# Altium project XPIRL_1V2.PrjPCB
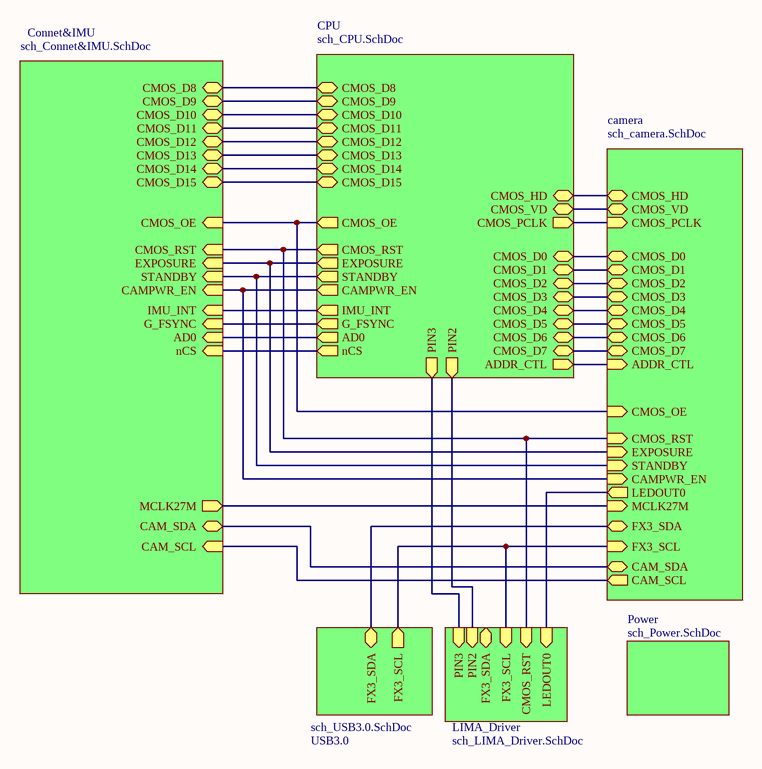
[diagram p0: sch_Top.SchDoc]
7 sheets, 248 parts. Net scope: hierarchical (ports join the sheet entries above them; power ports are global).
Sheets:
  sch_Top.SchDoc
    CPU = sch_CPU.SchDoc
    Connet&IMU = sch_Connet&IMU.SchDoc
    camera = sch_camera.SchDoc
    USB3.0 = sch_USB3.0.SchDoc
    Power = sch_Power.SchDoc
    LIMA_Driver = sch_LIMA_Driver.SchDoc

## Sheet sch_Top.SchDoc
size A4

### Sub-sheets
camera = sch_camera.SchDoc: CMOS_D0 (bidir), CMOS_D1 (bidir), CMOS_D2 (bidir), CMOS_D3 (bidir), CMOS_D4 (bidir), CMOS_D5 (bidir), CMOS_D6 (bidir), CMOS_D7 (bidir), CAMPWR_EN (in), CMOS_HD (bidir), CMOS_VD (bidir), CMOS_OE (in), CMOS_PCLK (in), CMOS_RST (in), EXPOSURE (in), STANDBY (in), ADDR_CTL (in), FX3_SCL (in), FX3_SDA (bidir), MCLK27M (in), LEDOUT0 (out), CAM_SDA (bidir), CAM_SCL (out)
Connet&IMU = sch_Connet&IMU.SchDoc: CAM_SCL (in), AD0 (in), nCS (in), STANDBY (in), EXPOSURE (in), CMOS_OE (in), CAMPWR_EN (in), CMOS_RST (in), CAM_SDA (bidir), CMOS_D8 (bidir), CMOS_D9 (bidir), CMOS_D10 (bidir), CMOS_D11 (bidir), CMOS_D12 (bidir), CMOS_D13 (bidir), CMOS_D14 (bidir), CMOS_D15 (bidir), IMU_INT (in), G_FSYNC (in), MCLK27M (out)
CPU = sch_CPU.SchDoc: AD0 (out), ADDR_CTL (out), CAMPWR_EN (out), CMOS_D0 (bidir), CMOS_D1 (bidir), CMOS_D2 (bidir), CMOS_D3 (bidir), CMOS_D4 (bidir), CMOS_D5 (bidir), CMOS_D6 (bidir), CMOS_D7 (bidir), CMOS_D8 (bidir), CMOS_D9 (bidir), CMOS_D10 (bidir), CMOS_D11 (bidir), CMOS_D12 (bidir), CMOS_D13 (bidir), CMOS_D14 (bidir), CMOS_D15 (bidir), CMOS_HD (bidir), CMOS_VD (bidir), CMOS_OE (out), CMOS_PCLK (out), CMOS_RST (out), EXPOSURE (out), IMU_INT (out), G_FSYNC (out), STANDBY (out), nCS (out), PIN3 (out), PIN2 (out)
LIMA_Driver = sch_LIMA_Driver.SchDoc: FX3_SDA (bidir), FX3_SCL (in), LEDOUT0 (in), PIN3 (in), PIN2 (in), CMOS_RST (in)
Power = sch_Power.SchDoc: no entries
USB3.0 = sch_USB3.0.SchDoc: FX3_SDA (bidir), FX3_SCL (out)

### Nets
AD0: sheet CPU/AD0, sheet Connet&IMU/AD0
ADDR_CTL: sheet CPU/ADDR_CTL, sheet camera/ADDR_CTL
CAM_SCL: sheet Connet&IMU/CAM_SCL, sheet camera/CAM_SCL
CAM_SDA: sheet Connet&IMU/CAM_SDA, sheet camera/CAM_SDA
CAMPWR_EN: sheet CPU/CAMPWR_EN, sheet Connet&IMU/CAMPWR_EN, sheet camera/CAMPWR_EN
CMOS_D0: sheet CPU/CMOS_D0, sheet camera/CMOS_D0
CMOS_D1: sheet CPU/CMOS_D1, sheet camera/CMOS_D1
CMOS_D2: sheet CPU/CMOS_D2, sheet camera/CMOS_D2
CMOS_D3: sheet CPU/CMOS_D3, sheet camera/CMOS_D3
CMOS_D4: sheet CPU/CMOS_D4, sheet camera/CMOS_D4
CMOS_D5: sheet CPU/CMOS_D5, sheet camera/CMOS_D5
CMOS_D6: sheet CPU/CMOS_D6, sheet camera/CMOS_D6
CMOS_D7: sheet CPU/CMOS_D7, sheet camera/CMOS_D7
CMOS_D8: sheet CPU/CMOS_D8, sheet Connet&IMU/CMOS_D8
CMOS_D9: sheet CPU/CMOS_D9, sheet Connet&IMU/CMOS_D9
CMOS_D10: sheet CPU/CMOS_D10, sheet Connet&IMU/CMOS_D10
CMOS_D11: sheet CPU/CMOS_D11, sheet Connet&IMU/CMOS_D11
CMOS_D12: sheet CPU/CMOS_D12, sheet Connet&IMU/CMOS_D12
CMOS_D13: sheet CPU/CMOS_D13, sheet Connet&IMU/CMOS_D13
CMOS_D14: sheet CPU/CMOS_D14, sheet Connet&IMU/CMOS_D14
CMOS_D15: sheet CPU/CMOS_D15, sheet Connet&IMU/CMOS_D15
CMOS_HD: sheet CPU/CMOS_HD, sheet camera/CMOS_HD
CMOS_OE: sheet CPU/CMOS_OE, sheet Connet&IMU/CMOS_OE, sheet camera/CMOS_OE
CMOS_PCLK: sheet CPU/CMOS_PCLK, sheet camera/CMOS_PCLK
CMOS_RST: sheet CPU/CMOS_RST, sheet Connet&IMU/CMOS_RST, sheet camera/CMOS_RST, sheet LIMA_Driver/CMOS_RST
CMOS_VD: sheet CPU/CMOS_VD, sheet camera/CMOS_VD
EXPOSURE: sheet CPU/EXPOSURE, sheet Connet&IMU/EXPOSURE, sheet camera/EXPOSURE
FX3_SCL: sheet camera/FX3_SCL, sheet USB3.0/FX3_SCL, sheet LIMA_Driver/FX3_SCL
FX3_SDA: sheet camera/FX3_SDA, sheet USB3.0/FX3_SDA
G_FSYNC: sheet CPU/G_FSYNC, sheet Connet&IMU/G_FSYNC
IMU_INT: sheet CPU/IMU_INT, sheet Connet&IMU/IMU_INT
LEDOUT0: sheet camera/LEDOUT0, sheet LIMA_Driver/LEDOUT0
MCLK27M: sheet Connet&IMU/MCLK27M, sheet camera/MCLK27M
nCS: sheet CPU/nCS, sheet Connet&IMU/nCS
PIN2: sheet CPU/PIN2, sheet LIMA_Driver/PIN2
PIN3: sheet CPU/PIN3, sheet LIMA_Driver/PIN3
STANDBY: sheet CPU/STANDBY, sheet Connet&IMU/STANDBY, sheet camera/STANDBY

## Sheet sch_CPU.SchDoc
size A4
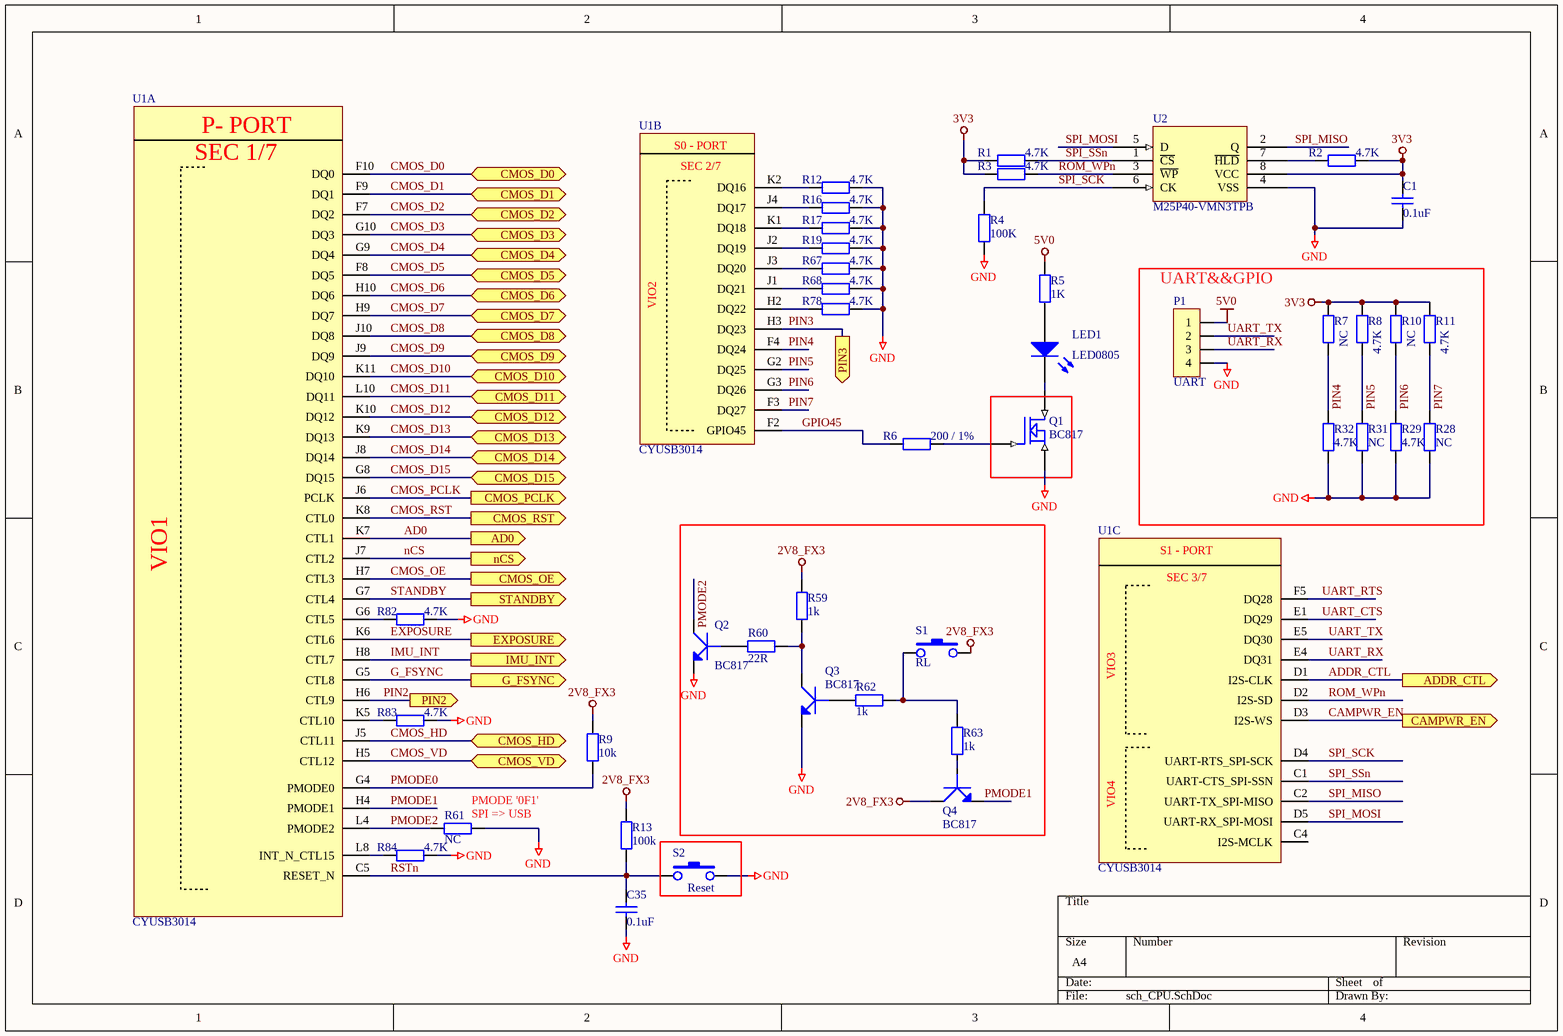
[diagram p1: sch_CPU.SchDoc]

### Parts
C1  0.1uF  [0402C]
C35  0.1uF  [0402C]
LED1  LED0805  [LED0805A_L210W100H60]
P1  UART  [WAFER4_P1.25L6.25W3.4H4.3]
Q1  BC817  [SOT-23L]
Q2  BC817  [SOT-23L]
Q3  BC817  [SOT-23L]
Q4  BC817  [SOT-23L]
R1  4.7K  [0402R]
R2  4.7K  [0402R]
R3  4.7K  [0402R]
R4  100K  [0402R]
R5  1K  [0402R]
R6  value 200 / 1%  [0402R]  (hidden comment: 200R)
R7  NC  [0402R]
R8  4.7K  [0402R]
R9  10K  [0402R]
R10  NC  [0402R]
R11  4.7K  [0402R]
R12  4.7K  [0402R]
R13  100K  [0402R]
R16  4.7K  [0402R]
R17  4.7K  [0402R]
R19  4.7K  [0402R]
R28  NC  [0402R]
R29  4.7K  [0402R]
R31  value NC  [0402R]  (hidden comment: NC\)
R32  4.7K  [0402R]
R59  1K  [0402R]
R60  22R  [0402R]
R61  NC  [0805R]
R62  1k  [0402R]
R63  1k  [0402R]
R67  4.7K  [0402R]
R68  4.7K  [0402R]
R78  4.7K  [0402R]
R82  4.7K  [0402R]
R83  4.7K  [0402R]
R84  4.7K  [0402R]
S1  RL  [SW_L40W30H25_MPTFP]
S2  Reset  [SW_L40W30H25_MPTFP]
U1  CYUSB3014  [FBGA121_P80L100W100H11]  (parts A,B,C of 7)
U2  M25P40-VMN3TPB  [SO8N_P127L50W40W62H17]

### Blocks framed on the sheet
UART&&GPIO: P1 R7 R8 R10 R11 R28 R29 R31 R32

### Ports
AD0 (out), ADDR_CTL (out), CAMPWR_EN (out), CMOS_D0 (bidir), CMOS_D1 (bidir), CMOS_D2 (bidir), CMOS_D3 (bidir), CMOS_D4 (bidir), CMOS_D5 (bidir), CMOS_D6 (bidir), CMOS_D7 (bidir), CMOS_D8 (bidir), CMOS_D9 (bidir), CMOS_D10 (bidir), CMOS_D11 (bidir), CMOS_D12 (bidir), CMOS_D13 (bidir), CMOS_D14 (bidir), CMOS_D15 (bidir), CMOS_HD (bidir), CMOS_OE (out), CMOS_PCLK (out), CMOS_RST (out), CMOS_VD (bidir), EXPOSURE (out), G_FSYNC (out), IMU_INT (out), nCS (out), PIN2 (out), PIN3 (out), STANDBY (out)

### Nets
2V8_FX3: Q4.3(C) R9.1 R13.1 R59.2 S1.1
3V3: C1.2 R1.1 R2.2 R3.1 R7.2 R8.2 R10.2 R11.2 U2.8(VCC)
5V0: P1.1 R5.1
GND: C1.1 C35.1 P1.4 Q1.2(S) Q2.2(E) Q3.2(E) R4.1 R12.2 R16.2 R17.2 R19.2 R28.2 R29.2 R31.2 R32.2 R61.1 R67.2 R68.2 R78.2 R82.2 R83.2 R84.2 S2.2 U2.4(VSS)
AD0: U1.K7(CTL1) ; port AD0
ADDR_CTL: U1.D1(I2S-CLK) ; port ADDR_CTL
CAMPWR_EN: U1.D3(I2S-WS) ; port CAMPWR_EN
CMOS_D0: U1.F10(DQ0) ; port CMOS_D0
CMOS_D1: U1.F9(DQ1) ; port CMOS_D1
CMOS_D2: U1.F7(DQ2) ; port CMOS_D2
CMOS_D3: U1.G10(DQ3) ; port CMOS_D3
CMOS_D4: U1.G9(DQ4) ; port CMOS_D4
CMOS_D5: U1.F8(DQ5) ; port CMOS_D5
CMOS_D6: U1.H10(DQ6) ; port CMOS_D6
CMOS_D7: U1.H9(DQ7) ; port CMOS_D7
CMOS_D8: U1.J10(DQ8) ; port CMOS_D8
CMOS_D9: U1.J9(DQ9) ; port CMOS_D9
CMOS_D10: U1.K11(DQ10) ; port CMOS_D10
CMOS_D11: U1.L10(DQ11) ; port CMOS_D11
CMOS_D12: U1.K10(DQ12) ; port CMOS_D12
CMOS_D13: U1.K9(DQ13) ; port CMOS_D13
CMOS_D14: U1.J8(DQ14) ; port CMOS_D14
CMOS_D15: U1.G8(DQ15) ; port CMOS_D15
CMOS_HD: U1.J5(CTL11) ; port CMOS_HD
CMOS_OE: U1.H7(CTL3) ; port CMOS_OE
CMOS_PCLK: U1.J6(PCLK) ; port CMOS_PCLK
CMOS_RST: U1.K8(CTL0) ; port CMOS_RST
CMOS_VD: U1.H5(CTL12) ; port CMOS_VD
EXPOSURE: U1.K6(CTL6) ; port EXPOSURE
G_FSYNC: U1.G5(CTL8) ; port G_FSYNC
GPIO45: R6.1 U1.F2(GPIO45)
IMU_INT: U1.H8(CTL7) ; port IMU_INT
nCS: U1.J7(CTL2) ; port nCS
PIN2: U1.H6(CTL9) ; port PIN2
PIN3: U1.H3(DQ23) ; port PIN3
PIN4: R7.1 R32.1 U1.F4(DQ24)
PIN5: R8.1 R31.1 U1.G2(DQ25)
PIN6: R10.1 R29.1 U1.G3(DQ26)
PIN7: R11.1 R28.1 U1.F3(DQ27)
PMODE0: R9.2 U1.G4(PMODE0)
PMODE1: Q4.2(E) U1.H4(PMODE1)
PMODE2: Q2.3(C) R61.2 U1.L4(PMODE2)
ROM_WPn: R3.2 U1.D2(I2S-SD) U2.3(~{WP})
RSTn: C35.2 R13.2 S2.1 U1.C5(RESET_N)
SPI_MISO: U1.C2(UART-TX_SPI-MISO) U2.2(Q)
SPI_MOSI: U1.D5(UART-RX_SPI-MOSI) U2.5(D)
SPI_SCK: R4.2 U1.D4(UART-RTS_SPI-SCK) U2.6(CK)
SPI_SSn: R1.2 U1.C1(UART-CTS_SPI-SSN) U2.1(~{CS})
STANDBY: U1.G7(CTL4) ; port STANDBY
UART_CTS: U1.E1(DQ29)
UART_RTS: U1.F5(DQ28)
UART_RX: P1.3 U1.E4(DQ31)
UART_TX: P1.2 U1.E5(DQ30)
NetLED1_1: LED1.1(A) R5.2
NetLED1_2: LED1.2(K) Q1.3(D)
NetQ1_1: Q1.1(G) R6.2
NetQ2_1: Q2.1(B) R60.1
NetQ3_1: Q3.1(B) R62.2
NetQ3_3: Q3.3(C) R59.1 R60.2
NetQ4_1: Q4.1(B) R63.2
NetR2_1: R2.1 U2.7(~{HLD})
NetR12_1: R12.1 U1.K2(DQ16)
NetR16_1: R16.1 U1.J4(DQ17)
NetR17_1: R17.1 U1.K1(DQ18)
NetR19_1: R19.1 U1.J2(DQ19)
NetR62_1: R62.1 R63.1 S1.2
NetR67_1: R67.1 U1.J3(DQ20)
NetR68_1: R68.1 U1.J1(DQ21)
NetR78_1: R78.1 U1.H2(DQ22)
NetR82_1: R82.1 U1.G6(CTL5)
NetR83_1: R83.1 U1.K5(CTL10)
NetR84_1: R84.1 U1.L8(INT_N_CTL15)

Not connected (* = marked no-connect by the designer): U1 C4(I2S-MCLK)

### Notes on the sheet
- (near R61) PMODE '0F1'
- (near R61) SPI => USB
- (in symbol CYUSB3014, part A) P- PORT; SEC 1/7; VIO1
- (in symbol CYUSB3014, part B) S0 - PORT; SEC 2/7
- (in symbol CYUSB3014, part C) S1 - PORT; SEC 3/7

### Library data of the parts
C1 C35 = Cap: Capacitor; Published: 8-Jun-2000; LatestRevisionDate: 17-Jul-2002; LatestRevisionNote: Re-released for DXP Platform.; PackageReference: RAD-0.3; Publisher: Altium Limited; Value: 0.1uF
LED1 = LED: 发光二级管
P1 = CON4
Q1 = MOSFET N
Q2-Q4 = NPN: NPN Transistor
R1-R13 R16 R17 R19 R28 R29 R31 R32 R59 R61-R63 R67 R68 R78 R82-R84 = Resistor: Published: 8-Jun-2000; LatestRevisionDate: 17-Jul-2002; LatestRevisionNote: Re-released for DXP Platform.; PackageReference: AXIAL-0.4; Publisher: Altium Limited
  R1-R3 R8 R11 R12 R16 R17 R19 R29 R32 R67 R68 R78 R82-R84: Value: 4.7K
  R4: Value: 100K
  R5: Value: 1K
  R7 R10 R28 R61: Value: NC
  R9: Value: 10k
  R13: Value: 100k
  R59 R62 R63: Value: 1k
R60 = Resistor: Value: 10k; Published: 8-Jun-2000; LatestRevisionDate: 17-Jul-2002; LatestRevisionNote: Re-released for DXP Platform.; PackageReference: AXIAL-0.4; Publisher: Altium Limited
S1 S2 = Button_sop: Value: BUTTON

## Sheet sch_Connet&IMU.SchDoc
size A4
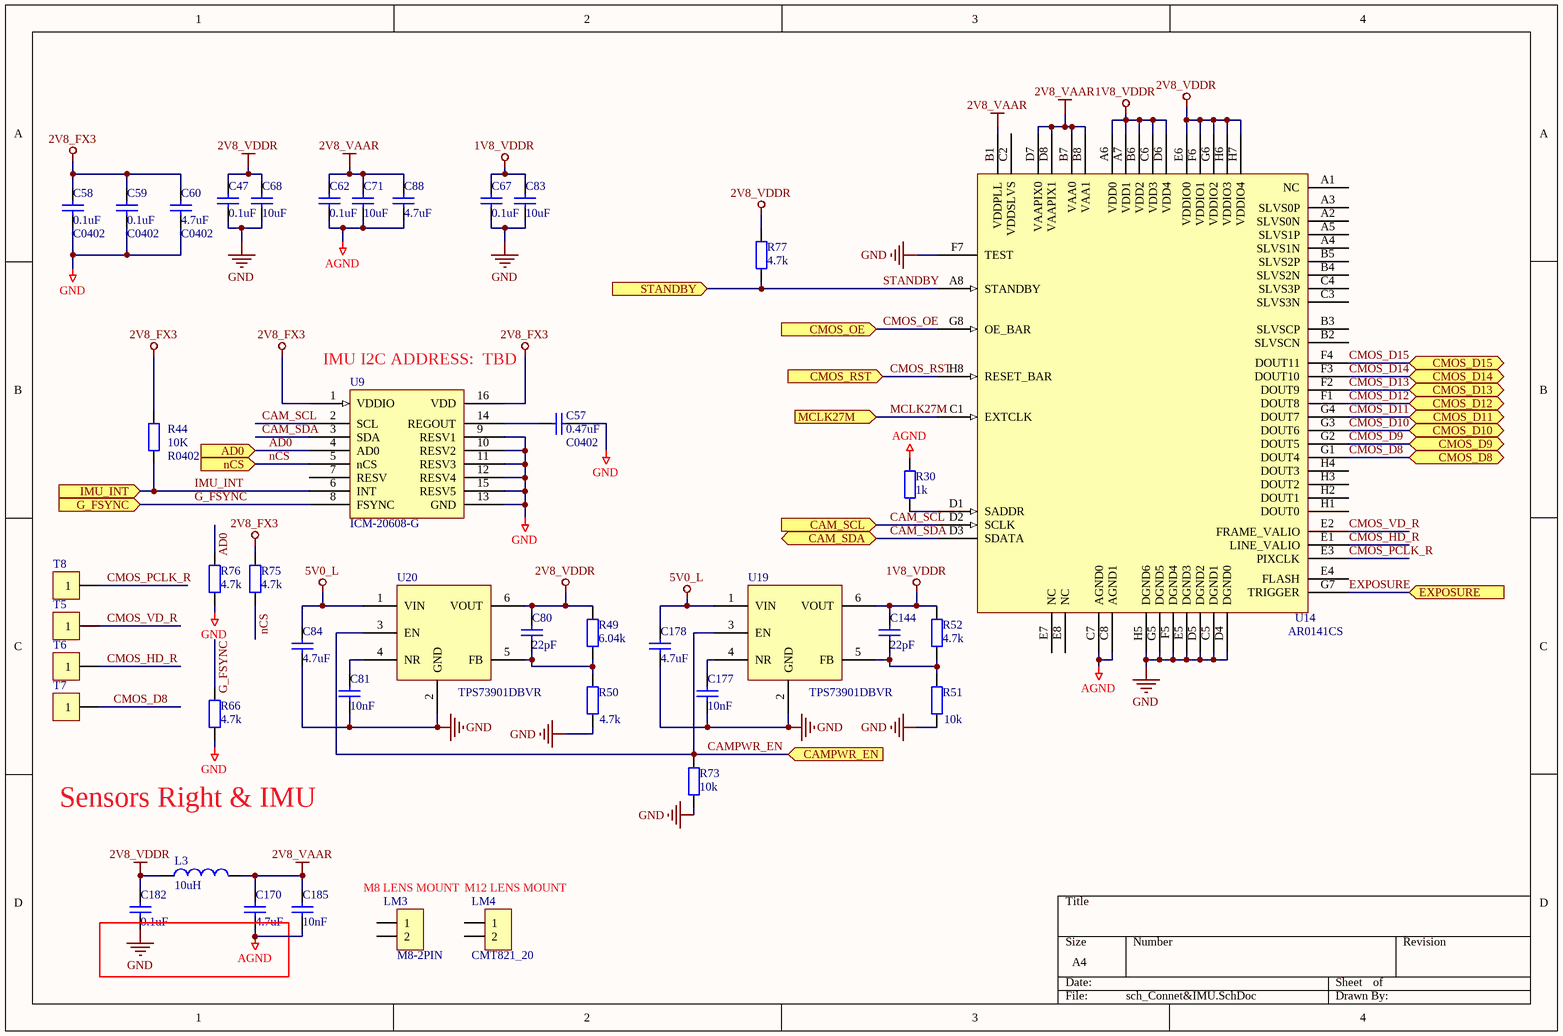
[diagram p2: sch_Connet&IMU.SchDoc]

### Parts
C47  0.1uF  [0402C]
C57  0.47uF  value C0402  [0402C]
C58  0.1uF  value C0402  [0402C]
C59  0.1uF  value C0402  [0402C]
C60  4.7uF  value C0402  [0402C]
C62  0.1uF  [0402C]
C67  0.1uF  [0402C]
C68  10uF  [0805C]
C71  10uF  [0805C]
C80  22pF  [0805C]
C81  10nF  [0402C_L]
C83  10uF  [0805C]
C84  4.7uF  [0402C_L]
C88  4.7uF  [0805C]
C144  22pF  [0402C]
C170  4.7uF  [0402C]
C177  10nF  [0402C_L]
C178  4.7uF  [0402C_L]
C182  0.1uF  [0402C_L]
C185  10nF  [0402C_L]
L3  10uH  [0805R]
LM3  M8-2PIN  [PAD_M3_D350_450]
LM4  CMT821_20  [PAD_M3_D350_450]
R30  1k  [0402R]
R44  10K  value R0402  [0402R]
R49  6.04K  [0402R]
R50  4.7K  [0402R]
R51  10K  [0402R]
R52  4.7K  [0402R]
R66  4.7K  [0402R]
R73  10K  [0402R_L]
R75  4.7K  [0402R]
R76  4.7K  [0402R]
R77  4.7K  [0402R]
T5  CON1  [PAD_TP_D1.2]  (value not drawn)
T6  CON1  [PAD_TP_D1.2]  (value not drawn)
T7  CON1  [PAD_TP_D1.2]  (value not drawn)
T8  CON1  [PAD_TP_D1.2]  (value not drawn)
U9  ICM-20608-G  [LGA16_P50L30W30H08]
U14  AR0141CS
U19  TPS73901DBVR
U20  TPS73901DBVR

### Ports
AD0 (in), CAM_SCL (in), CAM_SDA (bidir), CAMPWR_EN (in), CMOS_D8 (bidir), CMOS_D9 (bidir), CMOS_D10 (bidir), CMOS_D11 (bidir), CMOS_D12 (bidir), CMOS_D13 (bidir), CMOS_D14 (bidir), CMOS_D15 (bidir), CMOS_OE (in), CMOS_RST (in), EXPOSURE (in), G_FSYNC (in), IMU_INT (in), MCLK27M (in), nCS (in), STANDBY (in)

### Nets
1V8_VDDR: C67.2 C83.2 C144.2 R52.2 U14.A6(VDD0) U14.A7(VDD1) U14.B6(VDD2) U14.C6(VDD3) U14.D6(VDD4) U19.6(VOUT)
2V8_FX3: C58.2 C59.2 C60.2 R44.2 R75.2 U9.1(VDDIO) U9.16(VDD)
2V8_VAAR: C62.2 C71.2 C88.2 C170.2 C185.2 L3.2 U14.B1(VDDPLL) U14.B7(VAA0) U14.B8(VAA1) U14.D7(VAAPIX0) U14.D8(VAAPIX1)
2V8_VDDR: C47.2 C68.2 C80.2 C182.2 L3.1 R49.2 R77.2 U14.E6(VDDIO0) U14.F6(VDDIO1) U14.G6(VDDIO2) U14.H6(VDDIO3) U14.H7(VDDIO4) U20.6(VOUT)
5V0_L: C84.2 C178.2 U19.1(VIN) U20.1(VIN)
AGND: C62.1 C71.1 C88.1 C170.1 C185.1 R30.1 U14.C7(AGND0) U14.C8(AGND1)
GND: C47.1 C57.1 C58.1 C59.1 C60.1 C67.1 C68.1 C81.1 C83.1 C84.1 C177.1 C178.1 C182.1 R50.2 R51.2 R66.1 R73.2 R76.1 U9.9(RESV1) U9.10(RESV2) U9.11(RESV3) U9.12(RESV4) U9.13(GND) U9.15(RESV5) U14.C5(DGND1) U14.D4(DGND0) U14.D5(DGND2) U14.E5(DGND3) U14.F5(DGND4) U14.F7(TEST) U14.G5(DGND5) U14.H5(DGND6) U19.2(GND) U20.2(GND)
AD0: R76.2 U9.4(AD0) ; port AD0
CAM_SCL: U9.2(SCL) U14.D2(SCLK) ; port CAM_SCL
CAM_SDA: U9.3(SDA) U14.D3(SDATA) ; port CAM_SDA
CAMPWR_EN: R73.1 U19.3(EN) U20.3(EN) ; port CAMPWR_EN
CMOS_D8: T7.1 U14.G1(DOUT4) ; port CMOS_D8
CMOS_D9: U14.G2(DOUT5) ; port CMOS_D9
CMOS_D10: U14.G3(DOUT6) ; port CMOS_D10
CMOS_D11: U14.G4(DOUT7) ; port CMOS_D11
CMOS_D12: U14.F1(DOUT8) ; port CMOS_D12
CMOS_D13: U14.F2(DOUT9) ; port CMOS_D13
CMOS_D14: U14.F3(DOUT10) ; port CMOS_D14
CMOS_D15: U14.F4(DOUT11) ; port CMOS_D15
CMOS_HD_R: T6.1 U14.E1(LINE_VALIO)
CMOS_OE: U14.G8(OE_BAR) ; port CMOS_OE
CMOS_PCLK_R: T8.1 U14.E3(PIXCLK)
CMOS_RST: U14.H8(RESET_BAR) ; port CMOS_RST
CMOS_VD_R: T5.1 U14.E2(FRAME_VALIO)
EXPOSURE: U14.G7(TRIGGER) ; port EXPOSURE
G_FSYNC: R66.2 U9.8(FSYNC) ; port G_FSYNC
IMU_INT: R44.1 U9.6(INT) ; port IMU_INT
MCLK27M: U14.C1(EXTCLK) ; port MCLK27M
nCS: R75.1 U9.5(nCS) ; port nCS
STANDBY: R77.1 U14.A8(STANDBY) ; port STANDBY
NetC57_2: C57.2 U9.14(REGOUT)
NetC80_1: C80.1 R49.1 R50.1 U20.5(FB)
NetC81_2: C81.2 U20.4(NR)
NetC144_1: C144.1 R51.1 R52.1 U19.5(FB)
NetC177_2: C177.2 U19.4(NR)
NetR30_2: R30.2 U14.D1(SADDR)

Not connected (* = marked no-connect by the designer): LM3 1 2; LM4 1 2; U9 7(RESV); U14 A1(NC) A2(SLVS0N) A3(SLVS0P) A4(SLVS1N) A5(SLVS1P) B2(SLVSCN) B3(SLVSCP) B4(SLVS2N) B5(SLVS2P) C2(VDDSLVS) C3(SLVS3N) C4(SLVS3P) E4(FLASH) E7(NC) E8(NC) H1(DOUT0) H2(DOUT1) H3(DOUT2) H4(DOUT3)

### Notes on the sheet
- (near U9) IMU I2C ADDRESS:  TBD
- Sensors Right & IMU
- (near LM3) M8 LENS MOUNT
- (near LM4) M12 LENS MOUNT

### Library data of the parts
C47 C57-C60 C62 C67 C68 C71 C80 C81 C83 C84 C88 C144 C170 C177 C178 C182 C185 = Cap: Capacitor; Published: 8-Jun-2000; LatestRevisionDate: 17-Jul-2002; LatestRevisionNote: Re-released for DXP Platform.; Publisher: Altium Limited
  C47 C62 C67 C182: Value: 0.1uF
  C57-C60: PackageReference: RAD-0.3
  C68 C71 C83: PackageReference: RAD-0.3; Value: 10uF
  C80 C144: PackageReference: RAD-0.3; Value: 22pF
  C81 C177: PackageReference: RAD-0.3; Value: 10nF
  C84 C88 C170 C178: PackageReference: RAD-0.3; Value: 4.7uF
  C185: Value: 10nF
L3 = Inductor: Value: 330mH
LM3 LM4 = CON2: Connector
R30 R44 = Res2: Resistor; Published: 8-Jun-2000; LatestRevisionDate: 17-Jul-2002; LatestRevisionNote: Re-released for DXP Platform.; PackageReference: AXIAL-0.4; Publisher: Altium Limited
  R30: Value: 1k
R49-R52 R66 R73 R75-R77 = Resistor: Published: 8-Jun-2000; LatestRevisionDate: 17-Jul-2002; LatestRevisionNote: Re-released for DXP Platform.; PackageReference: AXIAL-0.4; Publisher: Altium Limited
  R49: Value: 6.04k
  R50 R52 R66 R75-R77: Value: 4.7k
  R51 R73: Value: 10k
T5-T8 = CON1: Connector

## Sheet sch_camera.SchDoc
size A4
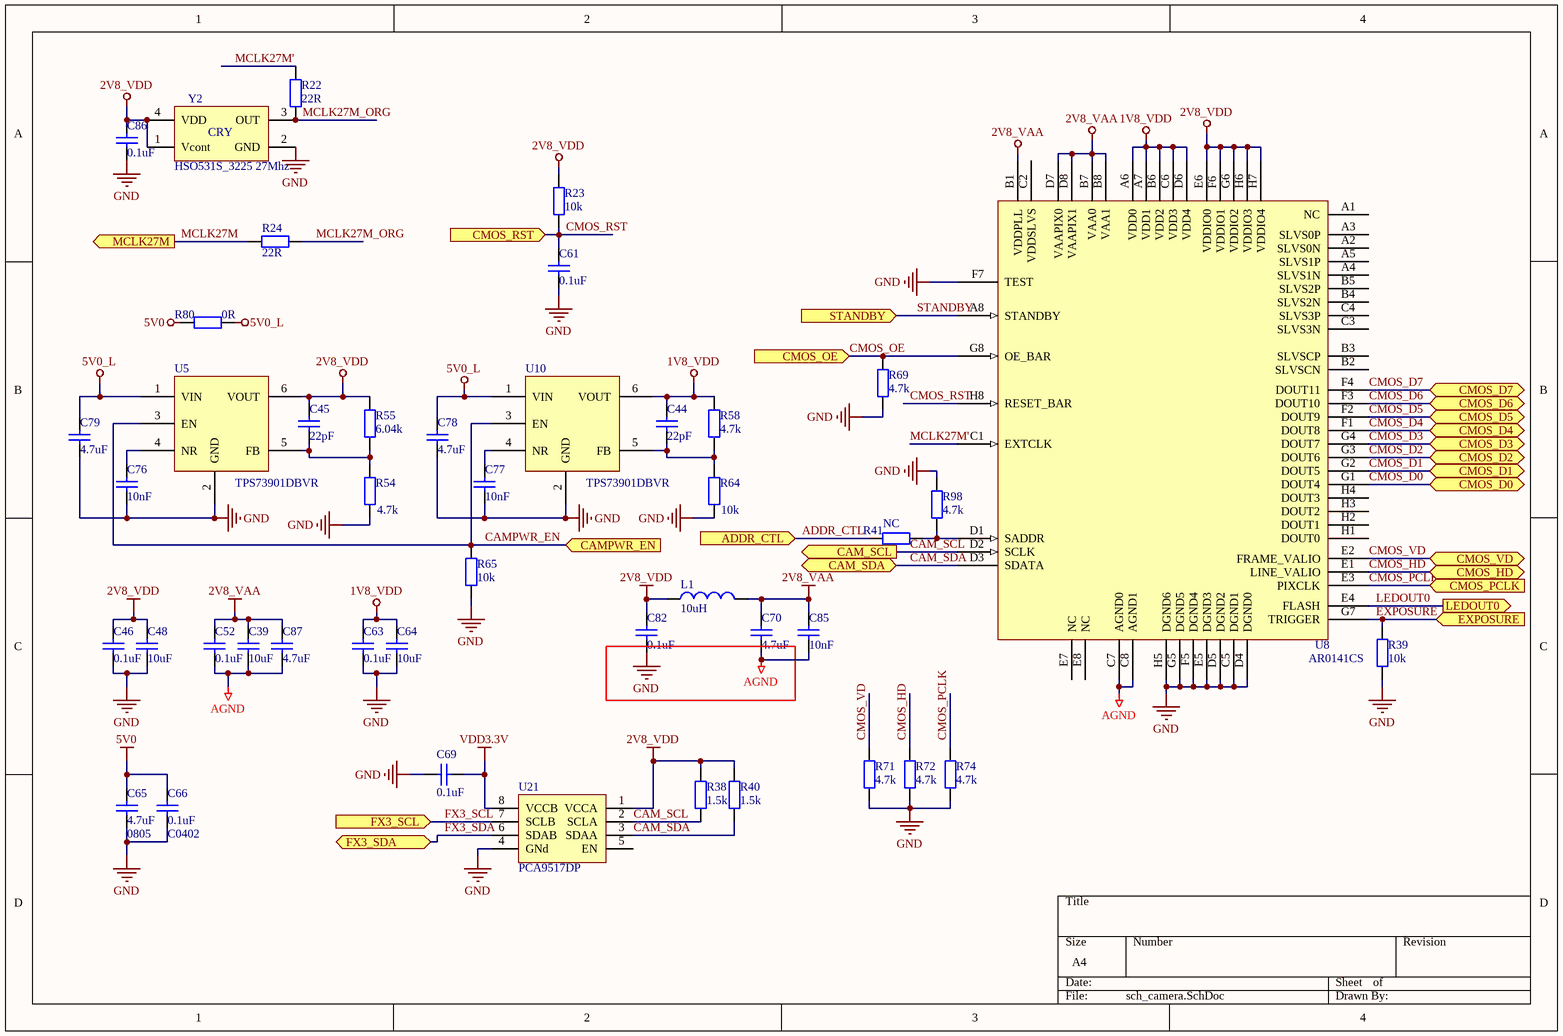
[diagram p3: sch_camera.SchDoc]

### Parts
C39  10uF  [0805C]
C44  22pF  [0402C]
C45  22pF  [0805C]
C46  0.1uF  [0402C]
C48  10uF  [0805C]
C52  0.1uF  [0402C]
C61  0.1uF  [0402C_L]
C63  0.1uF  [0402C]
C64  10uF  [0805C]
C65  4.7uF  value 0805  [0805C]
C66  0.1uF  value C0402  [0402C]
C69  0.1uF  [0402C]
C70  4.7uF  [0402C]
C76  10nF  [0402C_L]
C77  10nF  [0402C_L]
C78  value 4.7uF  [0402C_L]  (hidden comment: 1uF)
C79  value 4.7uF  [0402C_L]  (hidden comment: 1uF)
C82  0.1uF  [0402C_L]
C85  10nF  [0402C_L]
C86  0.1uF  [0402C_L]
C87  4.7uF
L1  10uH  [0805R]
R22  value 22R  [0402R_L]  (hidden comment: 0R)
R23  10K  [0402R_L]
R24  22R  [0402R]
R38  1.5K  [0402R_L]
R39  10K  [0402R_L]
R40  1.5K  [0402R_L]
R41  NC  [0402R_L]
R54  4.7K  [0402R]
R55  6.04K  [0402R]
R58  4.7K  [0402R]
R64  10K  [0402R]
R65  10K  [0402R_L]
R69  4.7K  [0402R_L]
R71  4.7K  [0402R_L]
R72  4.7K  [0402R_L]
R74  4.7K  [0402R_L]
R80  0R  [0402R]
R98  4.7K  [0402R_L]
U5  TPS73901DBVR
U8  AR0141CS
U10  TPS73901DBVR
U21  PCA9517DP
Y2  HSO531S_3225 27Mhz  [XTAL_3225]

### Ports
ADDR_CTL (in), CAM_SCL (out), CAM_SDA (bidir), CAMPWR_EN (in), CMOS_D0 (bidir), CMOS_D1 (bidir), CMOS_D2 (bidir), CMOS_D3 (bidir), CMOS_D4 (bidir), CMOS_D5 (bidir), CMOS_D6 (bidir), CMOS_D7 (bidir), CMOS_HD (bidir), CMOS_OE (in), CMOS_PCLK (in), CMOS_RST (in), CMOS_VD (bidir), EXPOSURE (in), FX3_SCL (in), FX3_SDA (bidir), LEDOUT0 (out), MCLK27M (out), STANDBY (in)

### Nets
1V8_VDD: C44.2 C63.2 C64.2 R58.2 U8.A6(VDD0) U8.A7(VDD1) U8.B6(VDD2) U8.C6(VDD3) U8.D6(VDD4) U10.6(VOUT)
2V8_VAA: C39.2 C52.2 C70.2 C85.2 C87.2 L1.2 U8.B1(VDDPLL) U8.B7(VAA0) U8.B8(VAA1) U8.D7(VAAPIX0) U8.D8(VAAPIX1)
2V8_VDD: C45.2 C46.2 C48.2 C82.2 C86.2 L1.1 R23.2 R38.2 R40.2 R55.2 U5.6(VOUT) U8.E6(VDDIO0) U8.F6(VDDIO1) U8.G6(VDDIO2) U8.H6(VDDIO3) U8.H7(VDDIO4) U21.1(VCCA) Y2.1(Vcont) Y2.4(VDD)
5V0: C65.2 C66.2 R80.1
5V0_L: C78.2 C79.2 R80.2 U5.1(VIN) U10.1(VIN)
AGND: C39.1 C52.1 C70.1 C85.1 C87.1 U8.C7(AGND0) U8.C8(AGND1)
GND: C46.1 C48.1 C61.1 C63.1 C64.1 C65.1 C66.1 C69.2 C76.1 C77.1 C78.1 C79.1 C82.1 C86.1 R39.2 R54.2 R64.2 R65.2 R69.1 R71.2 R72.2 R74.2 R98.1 U5.2(GND) U8.C5(DGND1) U8.D4(DGND0) U8.D5(DGND2) U8.E5(DGND3) U8.F5(DGND4) U8.F7(TEST) U8.G5(DGND5) U8.H5(DGND6) U10.2(GND) U21.4(GNd) Y2.2(GND)
VDD3.3V: C69.1 U21.8(VCCB)
ADDR_CTL: R41.2 ; port ADDR_CTL
CAM_SCL: R38.1 U8.D2(SCLK) U21.2(SCLA) ; port CAM_SCL
CAM_SDA: R40.1 U8.D3(SDATA) U21.3(SDAA) ; port CAM_SDA
CAMPWR_EN: R65.1 U5.3(EN) U10.3(EN) ; port CAMPWR_EN
CMOS_D0: U8.G1(DOUT4) ; port CMOS_D0
CMOS_D1: U8.G2(DOUT5) ; port CMOS_D1
CMOS_D2: U8.G3(DOUT6) ; port CMOS_D2
CMOS_D3: U8.G4(DOUT7) ; port CMOS_D3
CMOS_D4: U8.F1(DOUT8) ; port CMOS_D4
CMOS_D5: U8.F2(DOUT9) ; port CMOS_D5
CMOS_D6: U8.F3(DOUT10) ; port CMOS_D6
CMOS_D7: U8.F4(DOUT11) ; port CMOS_D7
CMOS_HD: R72.1 U8.E1(LINE_VALIO) ; port CMOS_HD
CMOS_OE: R69.2 U8.G8(OE_BAR) ; port CMOS_OE
CMOS_PCLK: R74.1 U8.E3(PIXCLK) ; port CMOS_PCLK
CMOS_RST: C61.2 R23.1 U8.H8(RESET_BAR) ; port CMOS_RST
CMOS_VD: R71.1 U8.E2(FRAME_VALIO) ; port CMOS_VD
EXPOSURE: R39.1 U8.G7(TRIGGER) ; port EXPOSURE
FX3_SCL: U21.7(SCLB) ; port FX3_SCL
FX3_SDA: U21.6(SDAB) ; port FX3_SDA
LEDOUT0: U8.E4(FLASH) ; port LEDOUT0
MCLK27M: R24.1 ; port MCLK27M
MCLK27M': R22.1 U8.C1(EXTCLK)
MCLK27M_ORG: R22.2 R24.2 Y2.3(OUT)
STANDBY: U8.A8(STANDBY) ; port STANDBY
NetC44_1: C44.1 R58.1 R64.1 U10.5(FB)
NetC45_1: C45.1 R54.1 R55.1 U5.5(FB)
NetC76_2: C76.2 U5.4(NR)
NetC77_2: C77.2 U10.4(NR)
NetR41_1: R41.1 R98.2 U8.D1(SADDR)

Not connected (* = marked no-connect by the designer): U8 A1(NC) A2(SLVS0N) A3(SLVS0P) A4(SLVS1N) A5(SLVS1P) B2(SLVSCN) B3(SLVSCP) B4(SLVS2N) B5(SLVS2P) C2(VDDSLVS) C3(SLVS3N) C4(SLVS3P) E7(NC) E8(NC) H1(DOUT0) H2(DOUT1) H3(DOUT2) H4(DOUT3); U21 5(EN)

### Library data of the parts
C39 C44-C46 C48 C52 C61 C63-C66 C70 C76-C79 C82 C85-C87 = Cap: Capacitor; Published: 8-Jun-2000; LatestRevisionDate: 17-Jul-2002; LatestRevisionNote: Re-released for DXP Platform.; Publisher: Altium Limited
  C39 C48 C64: PackageReference: RAD-0.3; Value: 10uF
  C44 C45: PackageReference: RAD-0.3; Value: 22pF
  C46 C52 C61 C63 C82 C86: Value: 0.1uF
  C65 C78 C79: PackageReference: RAD-0.3
  C70 C87: PackageReference: RAD-0.3; Value: 4.7uF
  C76 C77: PackageReference: RAD-0.3; Value: 10nF
  C85: Value: 10nF
C69 = Cap: Capacitor; Value: C0402; Published: 8-Jun-2000; LatestRevisionDate: 17-Jul-2002; LatestRevisionNote: Re-released for DXP Platform.; Publisher: Altium Limited
L1 = Inductor: Value: 330mH
R22-R24 R38-R41 R54 R55 R58 R64 R65 R69 R71 R72 R74 R80 R98 = Resistor: Published: 8-Jun-2000; LatestRevisionDate: 17-Jul-2002; LatestRevisionNote: Re-released for DXP Platform.; PackageReference: AXIAL-0.4; Publisher: Altium Limited
  R23 R39 R64 R65: Value: 10k
  R24: Value: 22R
  R38 R40: Value: 1.5k
  R41: Value: NC
  R54 R58 R69 R71 R72 R74 R98: Value: 4.7k
  R55: Value: 6.04k
  R80: Value: 0R
Y2 = CRY: 有源晶振

## Sheet sch_USB3.0.SchDoc
size A4
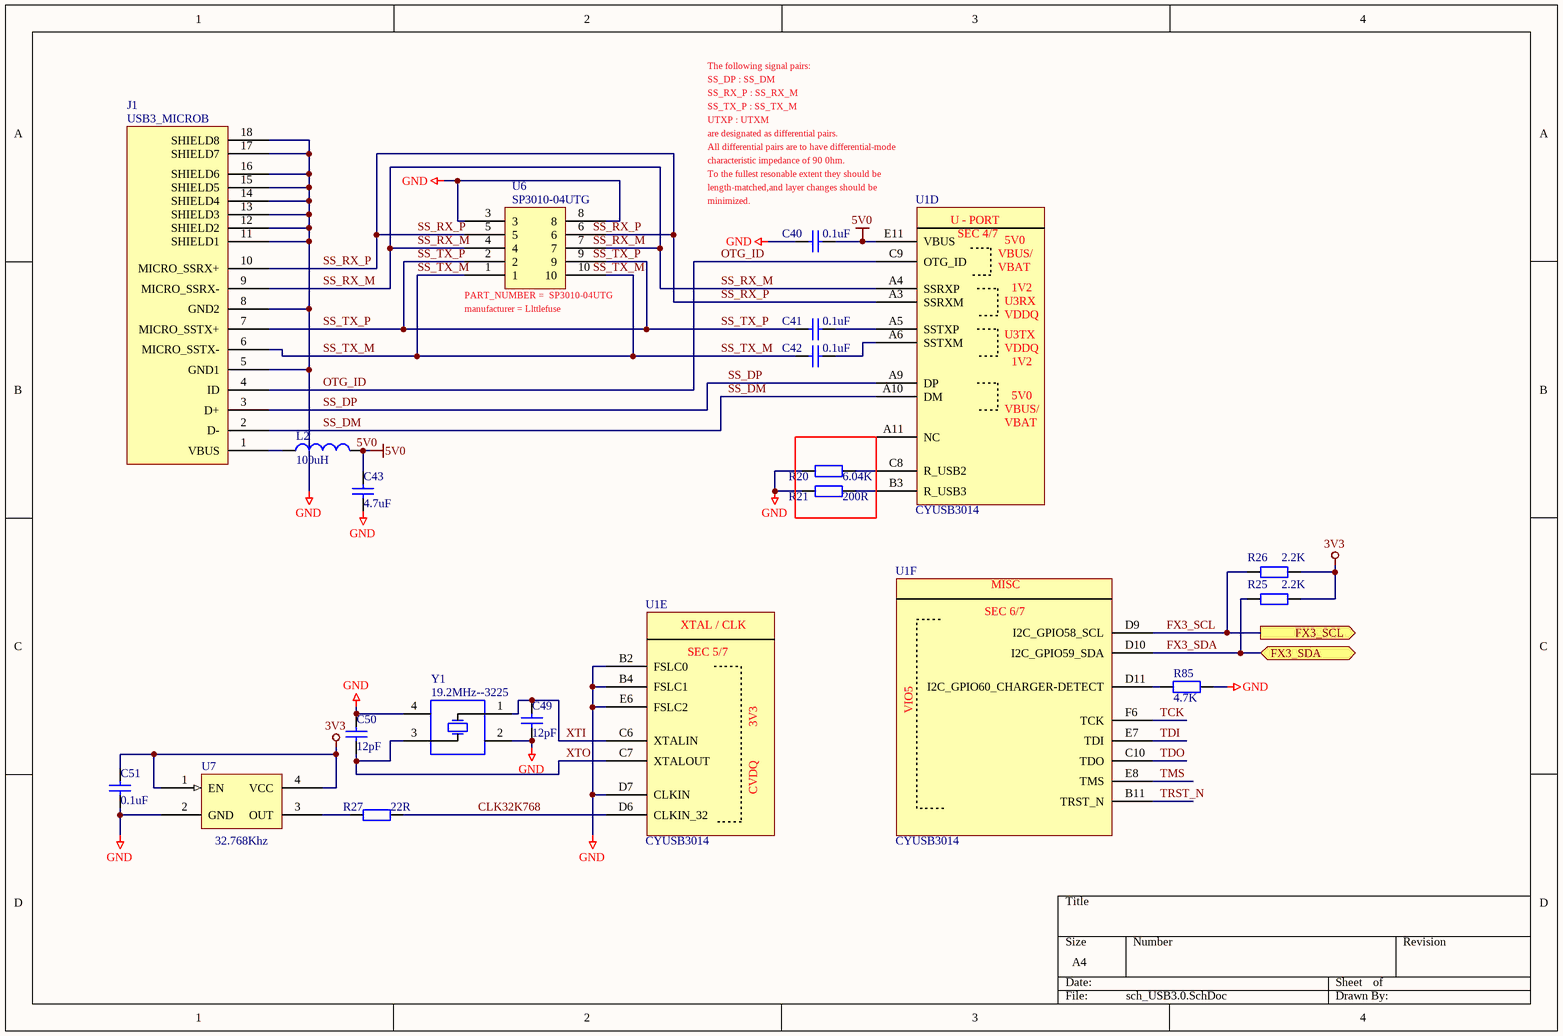
[diagram p4: sch_USB3.0.SchDoc]

### Parts
C40  0.1uF  [0402C]
C41  0.1uF  [0402C]
C42  0.1uF  [0402C]
C43  4.7uF
C49  12pF  [0402C]
C50  12pF  [0402C]
C51  0.1uF  [0402C]
J1  USB3_MICROB  [USB3_BA_P65L130W51H28]
L2  100uH
R20  6.04K  [0402R]
R21  200R  [0402R]
R25  2.2K  [0402R]
R26  2.2K  [0402R]
R27  22R  [0402R]
R85  4.7K  [0402R]
U1  CYUSB3014  [FBGA121_P80L100W100H11]  (parts D,E,F of 7)
U6  SP3010-04UTG  [UDFN10_SON_P50L25W10H55]
U7  XTAL-3225  [XTAL_3225]  (value not drawn)
Y1  19.2MHz--3225  [XTAL_3225]

### Ports
FX3_SCL (out), FX3_SDA (bidir)

### Nets
3V3: C51.2 R25.1 R26.1 U7.1(EN) U7.4(VCC)
5V0: C40.1 C43.2 L2.2 U1.E11(VBUS)
GND: C40.2 C43.1 C49.1 C50.2 C51.1 J1.5(GND1) J1.8(GND2) J1.11(SHIELD1) J1.12(SHIELD2) J1.13(SHIELD3) J1.14(SHIELD4) J1.15(SHIELD5) J1.16(SHIELD6) J1.17(SHIELD7) J1.18(SHIELD8) R20.2 R21.2 R85.1 U1.B2(FSLC0) U1.B4(FSLC1) U1.D7(CLKIN) U1.E6(FSLC2) U6.3 U6.8 U7.2(GND) Y1.2 Y1.4
CLK32K768: R27.1 U1.D6(CLKIN_32)
FX3_SCL: R26.2 U1.D9(I2C_GPIO58_SCL) ; port FX3_SCL
FX3_SDA: R25.2 U1.D10(I2C_GPIO59_SDA) ; port FX3_SDA
OTG_ID: J1.4(ID) U1.C9(OTG_ID)
SS_DM: J1.2(D-) U1.A10(DM)
SS_DP: J1.3(D+) U1.A9(DP)
SS_RX_M: J1.9(MICRO_SSRX-) U1.A4(SSRXP) U6.4 U6.7
SS_RX_P: J1.10(MICRO_SSRX+) U1.A3(SSRXM) U6.5 U6.6
SS_TX_M: C42.2 J1.6(MICRO_SSTX-) U6.1 U6.10
SS_TX_P: C41.2 J1.7(MICRO_SSTX+) U6.2 U6.9
TCK: U1.F6(TCK)
TDI: U1.E7(TDI)
TDO: U1.C10(TDO)
TMS: U1.E8(TMS)
TRST_N: U1.B11(TRST_N)
XTI: C49.2 U1.C6(XTALIN) Y1.1
XTO: C50.1 U1.C7(XTALOUT) Y1.3
NetC41_1: C41.1 U1.A5(SSTXP)
NetC42_1: C42.1 U1.A6(SSTXM)
NetJ1_1: J1.1(VBUS) L2.1
NetR20_1: R20.1 U1.C8(R_USB2)
NetR21_1: R21.1 U1.B3(R_USB3)
NetR27_2: R27.2 U7.3(OUT)
NetR85_2: R85.2 U1.D11(I2C_GPIO60_CHARGER-DETECT)

Not connected (* = marked no-connect by the designer): U1 A11(NC)

### Notes on the sheet
- The following signal pairs:
- SS_DP : SS_DM
- SS_RX_P : SS_RX_M
- SS_TX_P : SS_TX_M
- UTXP : UTXM
- are designated as differential pairs.
- All differential pairs are to have differential-mode
- characteristic impedance of 90 0hm.
- To the fullest resonable extent they should be
- length-matched,and layer changes should be
- minimized.
- (near U6) PART_NUMBER =  SP3010-04UTG
- (near U6) manufacturer = Llttlefuse
- (near U7) 32.768Khz
- Labels drawn without touching a wire or pin: 5V0, SS_RX_M, SS_RX_P, SS_TX_M, SS_TX_P
- (in symbol CYUSB3014, part D) U - PORT; SEC 4/7; 5V0; VBUS/; 1V2; U3RX; VDDQ; U3TX
- (in symbol CYUSB3014, part E) XTAL / CLK; SEC 5/7; 3V3; CVDQ
- (in symbol CYUSB3014, part F) MISC; SEC 6/7

### Library data of the parts
C40-C43 C49-C51 = Cap: Capacitor; Published: 8-Jun-2000; LatestRevisionDate: 17-Jul-2002; LatestRevisionNote: Re-released for DXP Platform.; PackageReference: RAD-0.3; Publisher: Altium Limited
  C40-C42 C51: Value: 0.1uF
  C43: Value: 4.7uF
L2 = Inductor: Value: 330mH
R20 = Resistor: Value: 43; Published: 8-Jun-2000; LatestRevisionDate: 17-Jul-2002; LatestRevisionNote: Re-released for DXP Platform.; PackageReference: AXIAL-0.4; Publisher: Altium Limited
R21 R25-R27 R85 = Resistor: Published: 8-Jun-2000; LatestRevisionDate: 17-Jul-2002; LatestRevisionNote: Re-released for DXP Platform.; PackageReference: AXIAL-0.4; Publisher: Altium Limited
  R85: Value: 4.7K
U7 = XTAL.
Y1 = XTAL: Crystal Oscillator

## Sheet sch_Power.SchDoc
size A4
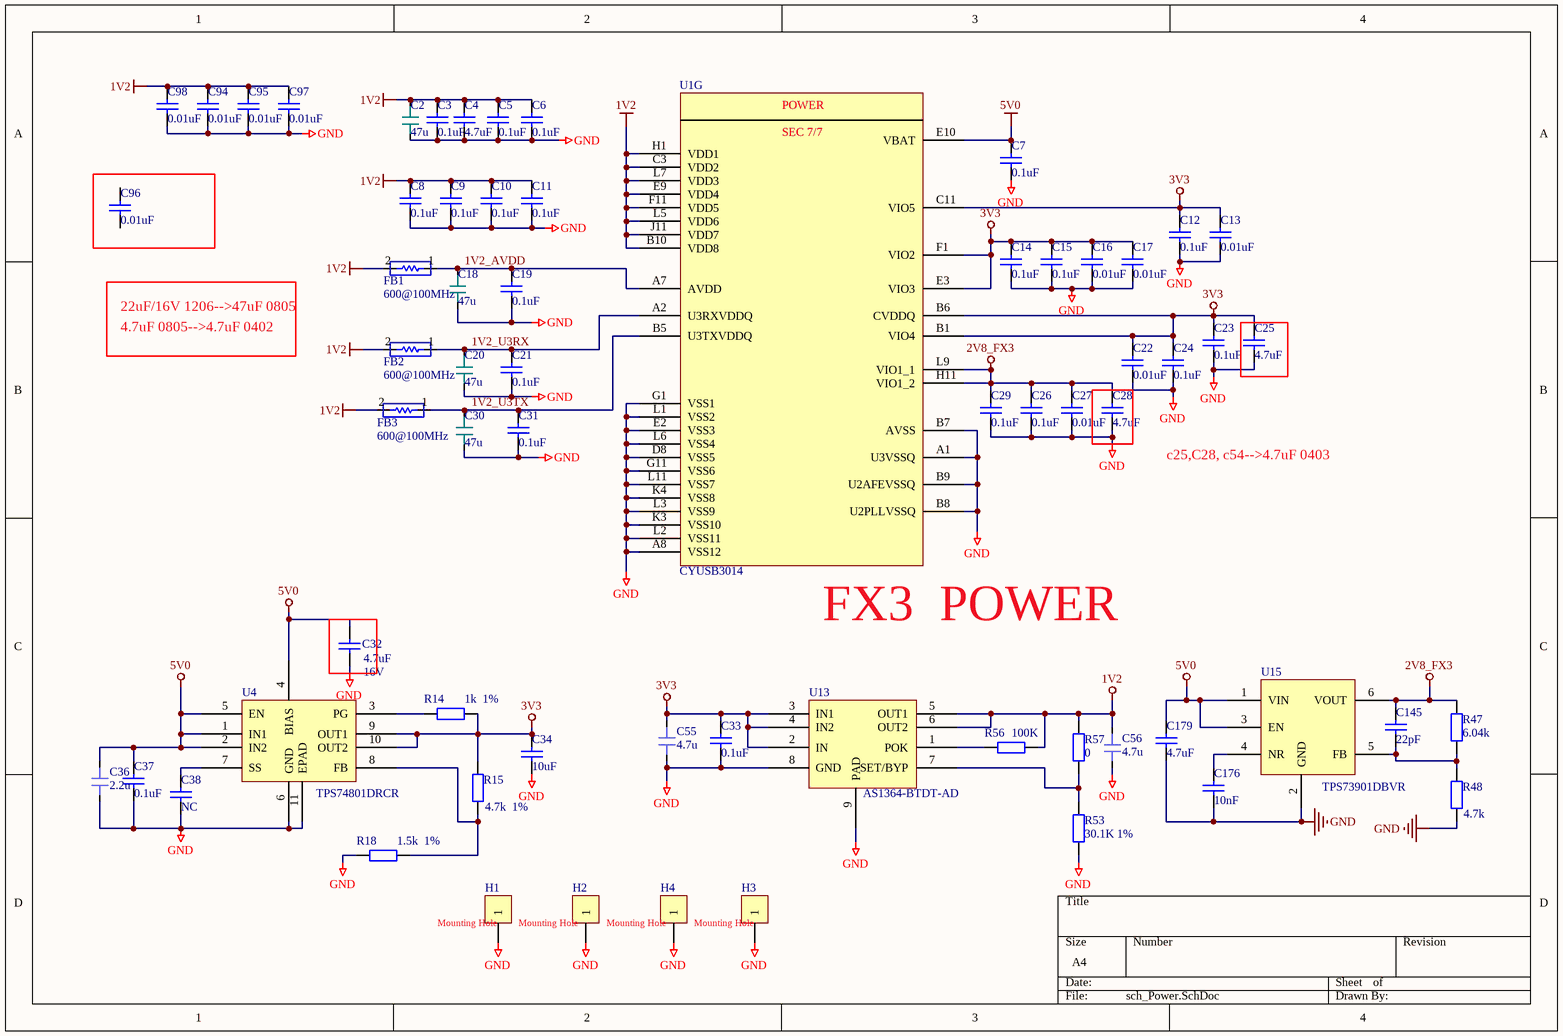
[diagram p5: sch_Power.SchDoc]

### Parts
C2  47u  [0805C]
C3  0.1uF  [0402C]
C4  value 4.7uF  [0402C]  (hidden comment: 0.1uF)
C5  0.1uF  [0402C]
C6  0.1uF  [0402C]
C7  0.1uF  [0402C]
C8  0.1uF  [0402C]
C9  0.1uF  [0402C]
C10  0.1uF  [0402C]
C11  0.1uF  [0402C]
C12  0.1uF  [0402C]
C13  0.01uF  [0402C]
C14  0.1uF  [0402C]
C15  0.1uF  [0402C]
C16  0.01uF  [0402C]
C17  0.01uF  [0402C]
C18  47u  [0805C]
C19  0.1uF  [0402C]
C20  47u  [0805C]
C21  0.1uF  [0402C]
C22  0.01uF  [0402C]
C23  0.1uF  [0402C]
C24  0.1uF  [0402C]
C25  4.7uF  [0402C]
C26  0.1uF  [0402C]
C27  0.01uF  [0402C]
C28  4.7uF  [0402C]
C29  0.1uF  [0402C]
C30  47u  [0805C]
C31  0.1uF  [0402C]
C32  4.7uF  value 16V  [0402C]
C33  0.1uF  [0402C]
C34  10uF  [0805C]
C36  2.2u  [0402C]
C37  0.1uF  [0402C]
C38  NC  [0402C]
C55  4.7u  [0402C]
C56  4.7u  [0402C]
C94  0.01uF  [0402C]
C95  0.01uF  [0402C]
C96  0.01uF  [0402C]
C97  0.01uF  [0402C]
C98  0.01uF  [0402C]
C145  22pF  [0805C]
C176  10nF  [0402C_L]
C179  4.7uF  [0402C_L]
FB1  600@100MHz  [0603R]
FB2  600@100MHz  [0603R]
FB3  600@100MHz  [0603R]
H1  CON1  [PAD_M3_D350_450]  (value not drawn)
H2  CON1  [PAD_M3_D350_450]  (value not drawn)
H3  CON1  [PAD_M3_D350_450]  (value not drawn)
H4  CON1  [PAD_M3_D350_450]  (value not drawn)
R14  value 1k  1%  [0402R]  (hidden comment: 1K)
R15  value 4.7k  1%  [0402R]  (hidden comment: 4.7K)
R18  value 1.5k  1%  [0402R]  (hidden comment: 1.5K)
R47  6.04K  [0402R]
R48  4.7K  [0402R]
R53  value 30.1K 1%  [0402R]  (hidden comment: 30.1K)
R56  100K  [0402R]
R57  value 0  [0402R]  (hidden comment: 0R)
U1  CYUSB3014  [FBGA121_P80L100W100H11]  (part G of 7)
U4  TPS74801DRCR  [SON10_P50L32W32H10_DRC]
U13  AS1364-BTDT-AD  [TDFN8_P65L30W30H08]
U15  TPS73901DBVR

### Nets
1V2: C2.1 C3.2 C4.2 C5.2 C6.2 C8.2 C9.2 C10.2 C11.2 C56.1 C94.2 C95.2 C97.2 C98.2 FB1.2 FB2.2 FB3.2 R56.1 R57.1 U1.B10(VDD8) U1.C3(VDD2) U1.E9(VDD4) U1.F11(VDD5) U1.H1(VDD1) U1.J11(VDD7) U1.L5(VDD6) U1.L7(VDD3) U13.5(OUT1) U13.6(OUT2)
2V8_FX3: C26.2 C27.2 C28.2 C29.2 C145.2 R47.2 U1.H11(VIO1_2) U1.L9(VIO1_1) U15.6(VOUT)
3V3: C12.2 C13.2 C14.2 C15.2 C16.2 C17.2 C22.2 C23.2 C24.2 C25.2 C33.2 C34.2 C55.1 R14.1 R15.1 U1.B1(VIO4) U1.B6(CVDDQ) U1.C11(VIO5) U1.E3(VIO3) U1.F1(VIO2) U4.9(OUT1) U4.10(OUT2) U13.2(IN) U13.3(IN1) U13.4(IN2)
5V0: C7.2 C32.1 C36.1 C37.2 C179.2 U1.E10(VBAT) U4.1(IN1) U4.2(IN2) U4.4(BIAS) U4.5(EN) U15.1(VIN) U15.3(EN)
GND: C2.2 C3.1 C4.1 C5.1 C6.1 C7.1 C8.1 C9.1 C10.1 C11.1 C12.1 C13.1 C14.1 C15.1 C16.1 C17.1 C18.2 C19.1 C20.2 C21.1 C22.1 C23.1 C24.1 C25.1 C26.1 C27.1 C28.1 C29.1 C30.2 C31.1 C32.2 C33.1 C34.1 C36.2 C37.1 C38.1 C55.2 C56.2 C94.1 C95.1 C97.1 C98.1 C176.1 C179.1 H1.1 H2.1 H3.1 H4.1 R18.2 R48.2 R53.2 U1.A1(U3VSSQ) U1.A8(VSS12) U1.B7(AVSS) U1.B8(U2PLLVSSQ) U1.B9(U2AFEVSSQ) U1.D8(VSS5) U1.E2(VSS3) U1.G1(VSS1) U1.G11(VSS6) U1.K3(VSS10) U1.K4(VSS8) U1.L1(VSS2) U1.L2(VSS11) U1.L3(VSS9) U1.L6(VSS4) U1.L11(VSS7) U4.6(GND) U4.11(EPAD) U13.8(GND) U13.9(PAD) U15.2(GND)
1V2_AVDD: C18.1 C19.2 FB1.1 U1.A7(AVDD)
1V2_U3RX: C20.1 C21.2 FB2.1 U1.A2(U3RXVDDQ)
1V2_U3TX: C30.1 C31.2 FB3.1 U1.B5(U3TXVDDQ)
NetC38_2: C38.2 U4.7(SS)
NetC145_1: C145.1 R47.1 R48.1 U15.5(FB)
NetC176_2: C176.2 U15.4(NR)
NetR14_2: R14.2 U4.3(PG)
NetR15_2: R15.2 R18.1 U4.8(FB)
NetR53_1: R53.1 R57.2 U13.7(SET/BYP)
NetR56_2: R56.2 U13.1(POK)

Not connected (* = marked no-connect by the designer): C96 1 2

### Notes on the sheet
- 22uF/16V 1206-->47uF 0805
- 4.7uF 0805-->4.7uF 0402
- c25,C28, c54-->4.7uF 0403
- (near U1) FX3  POWER
- (near H1) Mounting Hole
- (near H2) Mounting Hole
- (near H4) Mounting Hole
- (near H3) Mounting Hole
- (in symbol CYUSB3014, part G) POWER; SEC 7/7

### Library data of the parts
C2 C18 C20 C30 = cap0805: CC08052B476M5B20D; 元件类别: 贴片电容; 主物料厂家: YAGEO
C3-C17 C19 C21-C29 C31-C34 C37 C38 C94-C98 C145 C176 C179 = Cap: Capacitor; Published: 8-Jun-2000; LatestRevisionDate: 17-Jul-2002; LatestRevisionNote: Re-released for DXP Platform.; PackageReference: RAD-0.3; Publisher: Altium Limited
  C3 C5-C12 C14 C15 C19 C21 C23 C24 C26 C29 C31 C33 C37: Value: 0.1uF
  C13 C16 C17 C22 C27 C94-C98: Value: 0.01uF
  C25 C28 C179: Value: 4.7uF
  C34: Value: 10uF
  C38: Value: NC
  C145: Value: 22pF
  C176: Value: 10nF
C36 C55 C56 = cap0402: CC0402MRX5R5BB475; 元件类别: 贴片电容; 主物料厂家: YAGEO
H1-H4 = CON1: Connector
R14 R15 R18 R47 R48 R53 R56 R57 = Resistor: Published: 8-Jun-2000; LatestRevisionDate: 17-Jul-2002; LatestRevisionNote: Re-released for DXP Platform.; PackageReference: AXIAL-0.4; Publisher: Altium Limited
  R47: Value: 6.04k
  R48: Value: 4.7k
  R56: Value: 100K

## Sheet sch_LIMA_Driver.SchDoc
size A4
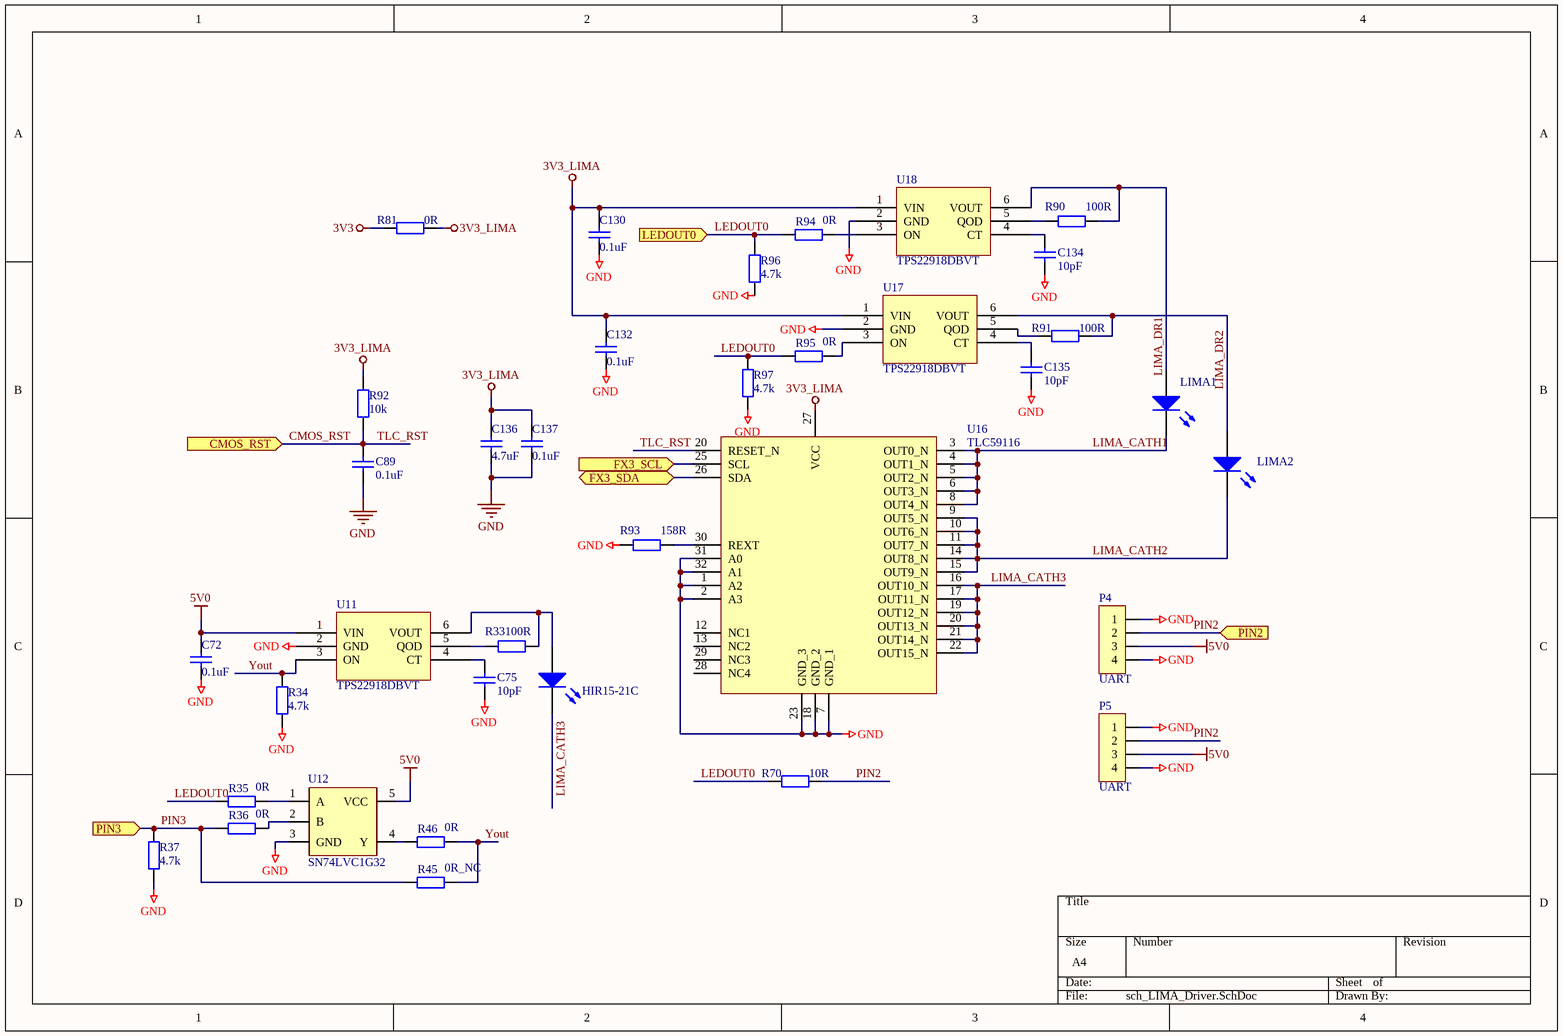
[diagram p6: sch_LIMA_Driver.SchDoc]

### Parts
C72  0.1uF
C75  10pF  [0603C_N]
C89  0.1uF  [0402C_L]
C130  0.1uF  [0402C_L]
C132  0.1uF  [0402C_L]
C134  10pF  [0402C_L]
C135  10pF  [0402C_L]
C136  4.7uF
C137  0.1uF  [0402C]
HIR15-21C  LIMA  [1206R]  (value not drawn)
LIMA1  LIMA  (value not drawn)
LIMA2  LIMA  (value not drawn)
P4  UART  [WAFER4_P1.25L6.25W3.4H4.3]
P5  UART  [WAFER4_P1.25L6.25W3.4H4.3]
R33  100R  [0603R_N]
R34  4.7k  [0603R_N]
R35  0R  [0603R_N]
R36  0R  [0603R_N]
R37  4.7k  [0603R_N]
R45  0R_NC  [0603R_N]
R46  0R  [0603R_N]
R70  10R  [0402R]
R81  0R  [0402R]
R90  100R  [0402R]
R91  100R  [0402R]
R92  10k  [0402R]
R93  158R  [0402R]
R94  0R  [0402R]
R95  0R  [0402R]
R96  4.7k  [0402R]
R97  4.7k  [0402R]
U11  TPS22918DBVT  [SOT23-6_P0.95X2.4_L3W4.2H1.1]
U12  SN74LVC1G32  [SOT23-5_P0.95X2.4_L3W4.2H1.1]
U16  TLC59116
U17  TPS22918DBVT
U18  TPS22918DBVT

### Ports
CMOS_RST (in), FX3_SCL (in), FX3_SDA (bidir), LEDOUT0 (in), PIN2 (in), PIN3 (in)

### Nets
3V3: R81.1
3V3_LIMA: C130.2 C132.2 C136.2 C137.2 R81.2 R92.1 U16.27(VCC) U17.1(VIN) U18.1(VIN)
5V0: C72.2 P4.3 P5.3 U11.1(VIN) U12.5(VCC)
GND: C72.1 C75.1 C89.1 C130.1 C132.1 C134.1 C135.1 C136.1 C137.1 P4.1 P4.4 P5.1 P5.4 R34.1 R37.1 R93.2 R96.1 R97.1 U11.2(GND) U12.3(GND) U16.1(A2) U16.2(A3) U16.7(GND_1) U16.18(GND_2) U16.23(GND_3) U16.31(A0) U16.32(A1) U17.2(GND) U18.2(GND)
CMOS_RST: C89.2 R92.2 U16.20(RESET_N) ; port CMOS_RST  [also labelled TLC_RST]
FX3_SCL: U16.25(SCL) ; port FX3_SCL
LEDOUT0: R35.2 R70.1 R94.2 R95.2 R96.2 R97.2 ; port LEDOUT0
LIMA_CATH1: LIMA1.2(K) U16.3(OUT0_N) U16.4(OUT1_N) U16.5(OUT2_N) U16.6(OUT3_N) U16.8(OUT4_N)
LIMA_CATH2: LIMA2.2(K) U16.9(OUT5_N) U16.10(OUT6_N) U16.11(OUT7_N) U16.14(OUT8_N) U16.15(OUT9_N)
LIMA_CATH3: HIR15-21C.2(K) U16.16(OUT10_N) U16.17(OUT11_N) U16.19(OUT12_N) U16.20(OUT13_N) U16.21(OUT14_N) U16.22(OUT15_N)
LIMA_DR2: LIMA2.1(A) R91.1 U17.6(VOUT)
PIN2: P4.2 P5.2 R70.2 ; port PIN2
PIN3: R36.2 R37.2 R45.2 ; port PIN3
Yout: R34.2 R45.1 R46.1 U11.3(ON)
NetC75_2: C75.2 U11.4(CT)
NetC134_2: C134.2 U18.4(CT)
NetC135_2: C135.2 U17.4(CT)
NetHIR15-21C_1: HIR15-21C.1(A) R33.1 U11.6(VOUT)
NetLIMA1_1: LIMA1.1(A) R90.1 U18.6(VOUT)
NetR33_2: R33.2 U11.5(QOD)
NetR35_1: R35.1 U12.1(A)
NetR36_1: R36.1 U12.2(B)
NetR46_2: R46.2 U12.4(Y)
NetR90_2: R90.2 U18.5(QOD)
NetR91_2: R91.2 U17.5(QOD)
NetR93_1: R93.1 U16.30(REXT)
NetR94_1: R94.1 U18.3(ON)
NetR95_1: R95.1 U17.3(ON)
NetU16_26: U16.26(SDA) ; port FX3_SDA

Not connected (* = marked no-connect by the designer): U16 12(NC1) 13(NC2) 28(NC4) 29(NC3)

### Notes on the sheet
- Labels drawn without touching a wire or pin: LIMA_DR1

### Library data of the parts
C72 C75 C89 C130 C132 C134 C135 = Cap: Capacitor; Published: 8-Jun-2000; LatestRevisionDate: 17-Jul-2002; LatestRevisionNote: Re-released for DXP Platform.; Publisher: Altium Limited
  C72 C89 C130 C132: Value: 0.1uF
  C75 C134 C135: Value: 10pF
C136 = Cap: Capacitor; Value: 0805; Published: 8-Jun-2000; LatestRevisionDate: 17-Jul-2002; LatestRevisionNote: Re-released for DXP Platform.; PackageReference: RAD-0.3; Publisher: Altium Limited
C137 = Cap: Capacitor; Value: C0402; Published: 8-Jun-2000; LatestRevisionDate: 17-Jul-2002; LatestRevisionNote: Re-released for DXP Platform.; Publisher: Altium Limited
HIR15-21C LIMA1 LIMA2 = LED: 发光二级管
P4 P5 = CON4
R33-R37 R45 R46 R90-R97 = Resistor: Value: 100; Published: 8-Jun-2000; LatestRevisionDate: 17-Jul-2002; LatestRevisionNote: Re-released for DXP Platform.; PackageReference: AXIAL-0.4; Publisher: Altium Limited
R70 R81 = Resistor: Published: 8-Jun-2000; LatestRevisionDate: 17-Jul-2002; LatestRevisionNote: Re-released for DXP Platform.; PackageReference: AXIAL-0.4; Publisher: Altium Limited
  R70: Value: 10R
  R81: Value: 0R

## Nets that join several sheets
2V8_FX3: sch_CPU (5 pins), sch_Connet&IMU (7 pins), sch_Power (9 pins)
3V3: sch_CPU (9 pins), sch_USB3.0 (5 pins), sch_Power (25 pins), sch_LIMA_Driver (R81.1)
5V0: sch_CPU (P1.1 R5.1), sch_camera (C65.2 C66.2 R80.1), sch_USB3.0 (C40.1 C43.2 L2.2 U1.E11), sch_Power (12 pins), sch_LIMA_Driver (5 pins)
5V0_L: sch_Connet&IMU (C84.2 C178.2 U19.1 U20.1), sch_camera (5 pins)
AGND: sch_Connet&IMU (8 pins), sch_camera (7 pins)
GND: sch_CPU (24 pins), sch_Connet&IMU (34 pins), sch_camera (35 pins), sch_USB3.0 (27 pins), sch_Power (72 pins), sch_LIMA_Driver (29 pins)
AD0: sch_CPU (U1.K7), sch_Connet&IMU (R76.2 U9.4)
ADDR_CTL: sch_CPU (U1.D1), sch_camera (R41.2)
CAM_SCL: sch_Connet&IMU (U9.2 U14.D2), sch_camera (R38.1 U8.D2 U21.2)
CAM_SDA: sch_Connet&IMU (U9.3 U14.D3), sch_camera (R40.1 U8.D3 U21.3)
CAMPWR_EN: sch_CPU (U1.D3), sch_Connet&IMU (R73.1 U19.3 U20.3), sch_camera (R65.1 U5.3 U10.3)
CMOS_D0: sch_CPU (U1.F10), sch_camera (U8.G1)
CMOS_D1: sch_CPU (U1.F9), sch_camera (U8.G2)
CMOS_D2: sch_CPU (U1.F7), sch_camera (U8.G3)
CMOS_D3: sch_CPU (U1.G10), sch_camera (U8.G4)
CMOS_D4: sch_CPU (U1.G9), sch_camera (U8.F1)
CMOS_D5: sch_CPU (U1.F8), sch_camera (U8.F2)
CMOS_D6: sch_CPU (U1.H10), sch_camera (U8.F3)
CMOS_D7: sch_CPU (U1.H9), sch_camera (U8.F4)
CMOS_D8: sch_CPU (U1.J10), sch_Connet&IMU (T7.1 U14.G1)
CMOS_D9: sch_CPU (U1.J9), sch_Connet&IMU (U14.G2)
CMOS_D10: sch_CPU (U1.K11), sch_Connet&IMU (U14.G3)
CMOS_D11: sch_CPU (U1.L10), sch_Connet&IMU (U14.G4)
CMOS_D12: sch_CPU (U1.K10), sch_Connet&IMU (U14.F1)
CMOS_D13: sch_CPU (U1.K9), sch_Connet&IMU (U14.F2)
CMOS_D14: sch_CPU (U1.J8), sch_Connet&IMU (U14.F3)
CMOS_D15: sch_CPU (U1.G8), sch_Connet&IMU (U14.F4)
CMOS_HD: sch_CPU (U1.J5), sch_camera (R72.1 U8.E1)
CMOS_OE: sch_CPU (U1.H7), sch_Connet&IMU (U14.G8), sch_camera (R69.2 U8.G8)
CMOS_PCLK: sch_CPU (U1.J6), sch_camera (R74.1 U8.E3)
CMOS_RST: sch_CPU (U1.K8), sch_Connet&IMU (U14.H8), sch_camera (C61.2 R23.1 U8.H8), sch_LIMA_Driver (C89.2 R92.2 U16.20)
CMOS_VD: sch_CPU (U1.H5), sch_camera (R71.1 U8.E2)
EXPOSURE: sch_CPU (U1.K6), sch_Connet&IMU (U14.G7), sch_camera (R39.1 U8.G7)
FX3_SCL: sch_camera (U21.7), sch_USB3.0 (R26.2 U1.D9), sch_LIMA_Driver (U16.25)
FX3_SDA: sch_camera (U21.6), sch_USB3.0 (R25.2 U1.D10)
G_FSYNC: sch_CPU (U1.G5), sch_Connet&IMU (R66.2 U9.8)
IMU_INT: sch_CPU (U1.H8), sch_Connet&IMU (R44.1 U9.6)
LEDOUT0: sch_camera (U8.E4), sch_LIMA_Driver (6 pins)
MCLK27M: sch_Connet&IMU (U14.C1), sch_camera (R24.1)
nCS: sch_CPU (U1.J7), sch_Connet&IMU (R75.1 U9.5)
PIN2: sch_CPU (U1.H6), sch_LIMA_Driver (P4.2 P5.2 R70.2)
PIN3: sch_CPU (U1.H3), sch_LIMA_Driver (R36.2 R37.2 R45.2)
STANDBY: sch_CPU (U1.G7), sch_Connet&IMU (R77.1 U14.A8), sch_camera (U8.A8)